# EAGLE design USB-LPC-Programmer_modular_V3.7 (EAGLE 6.4)
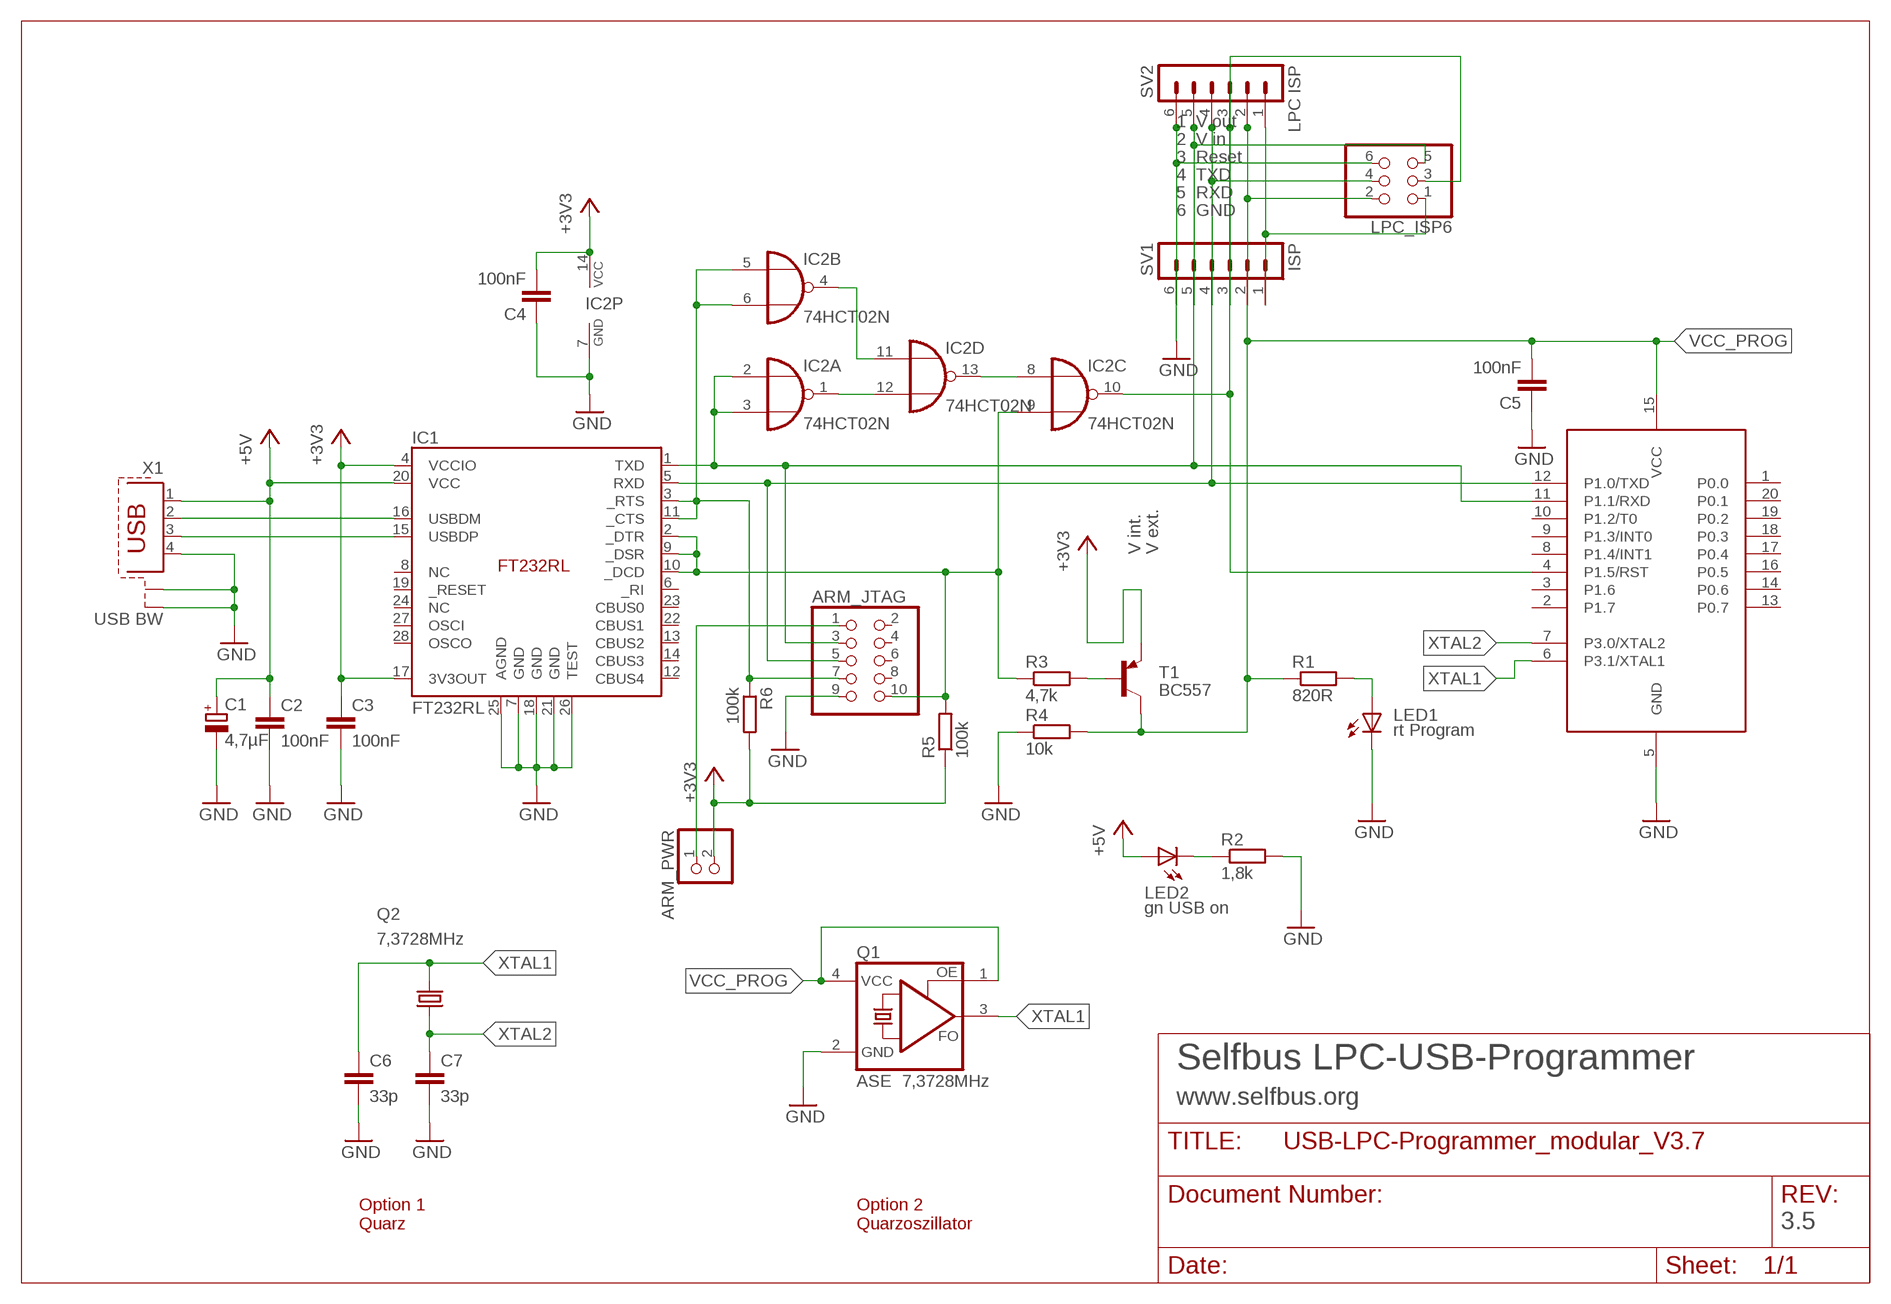
[diagram p0: schematic, sheet 1]

## Parts
89LPC922  LPC-Sockel  89LPC922  [DIL20]
ARM_JTAG  PINHD-2X05_2.00  [2X05M]
ARM_PWR  PINHD-1X02_2.54-S  [1X02-S]
C1  4,7µF  CPOL-EUE2.5-6  [E2,5-6]
C2  100nF  C-EU025-025X050  [C025-025X050]
C3  100nF  C-EU050-024X044  [C050-024X044]
C4  100nF  C-EU050-024X044  [C050-024X044]
C5  100nF  C-EU050-024X044  [C050-024X044]
C6  33p  C-EU025-024X044  [C025-024X044]
C7  33p  C-EU025-024X044  [C025-024X044]
IC1  FT232RL  [SSOP-28]
IC2  74HCT02N  [DIL14]
LED1  rt Program  LED3MM  [LED3MM]
LED2  gn USB on  LED3MM  [LED3MM]
LPC_ISP6  PINHD-2X3  [2X03]
Q1  ASE 7,3728MHz  ASF1  [ASF]
Q2  7,3728MHz  CRYSTALHC49S  [HC49/S]
R1  820R  R-EU_0207/7  [0207/7]
R2  1,8k  R-EU_0207/7  [0207/7]
R3  4,7k  R-EU_0204/7  [0204/7]
R4  10k  R-EU_0207/7  [0207/7]
R5  100k  R-EU_0207/7  [0207/7]
R6  100k  R-EU_0207/7  [0207/7]
SV1  ISP  MA06-1  [MA06-1]
SV2  LPC ISP  MA06-1  [MA06-1]
T1  BC557  [TO92]
X1  USB BW  PN61729-S  [PN61729-S]

## Nets
+3V3: ARM_PWR.2 C3.1 C4.2 IC1.4(VCCIO) IC1.17(3V3OUT) IC2.14(P:VCC) R5.1 R6.2 T1.1(E)
+5V: C1.+ C2.1 IC1.20(VCC) LED2.A X1.1
GND: 89LPC922.5(GND) ARM_JTAG.9 C1.- C2.2 C3.2 C4.1 C5.1 C6.2 C7.2 IC1.7(GND) IC1.18(GND) IC1.21(GND) IC1.25(AGND) IC1.26(TEST) IC2.7(P:GND) LED1.K(C) LPC_ISP6.6 Q1.2(GND) R2.2 R4.1 SV1.6 SV2.6 X1.4 X1.S1 X1.S2
N$1: LPC_ISP6.1 SV1.1 SV2.1
N$2: ARM_JTAG.1 ARM_PWR.1
N$3: IC2.4(B:O) IC2.11(D:I0)
N$5: 89LPC922.4(P1.5/RST) IC2.10(C:O) LPC_ISP6.3 SV1.3 SV2.3
N$9: LED2.K(C) R2.1
N$10: IC2.1(A:O) IC2.12(D:I1)
N$13: LED1.A R1.2
N$14: IC1.16(USBDM) X1.2
N$15: IC2.8(C:I0) IC2.13(D:O)
N$17: IC1.15(USBDP) X1.3
N$19: R3.2 T1.2(B)
PROG_PWR_ON: ARM_JTAG.10 IC1.2(_DTR) IC1.9(_DSR) IC1.10(_DCD) IC2.9(C:I1) R3.1 R5.2
RTS_CTS1: ARM_JTAG.7 IC1.3(_RTS) IC1.11(_CTS) IC2.5(B:I0) IC2.6(B:I1) R6.1
USB_RX: 89LPC922.12(P1.0/TXD) ARM_JTAG.5 IC1.5(RXD) LPC_ISP6.4 SV1.4 SV2.4
USB_TX: 89LPC922.11(P1.1/RXD) ARM_JTAG.3 IC1.1(TXD) IC2.2(A:I0) IC2.3(A:I1) LPC_ISP6.5 SV1.5 SV2.5
VCC_PROG: 89LPC922.15(VCC) C5.2 LPC_ISP6.2 Q1.1(OE) Q1.4(VCC) R1.1 R4.2 SV1.2 SV2.2 T1.3(C)
XTAL1: 89LPC922.6(P3.1/XTAL1) C6.1 Q1.3(FO) Q2.2
XTAL2: 89LPC922.7(P3.0/XTAL2) C7.1 Q2.1
Unconnected: 89LPC922.1(P0.0) 89LPC922.2(P1.7) 89LPC922.3(P1.6) 89LPC922.8(P1.4/INT1) 89LPC922.9(P1.3/INT0) 89LPC922.10(P1.2/T0) 89LPC922.13(P0.7) 89LPC922.14(P0.6) 89LPC922.16(P0.5) 89LPC922.17(P0.4) 89LPC922.18(P0.3) 89LPC922.19(P0.2) 89LPC922.20(P0.1) ARM_JTAG.2 ARM_JTAG.4 ARM_JTAG.6 ARM_JTAG.8 IC1.6(_RI) IC1.8(NC) IC1.12(CBUS4) IC1.13(CBUS2) IC1.14(CBUS3) IC1.19(_RESET) IC1.22(CBUS1) IC1.23(CBUS0) IC1.24(NC) IC1.27(OSCI) IC1.28(OSCO)

## Notes on the sheet
- 1  V out
- 2  V in
- 3  Reset
- 4  TXD
- 5  RXD
- 6  GND
- V int. | V ext.
- Selfbus LPC-USB-Programmer
- www.selfbus.org
- Option 1
  Quarz
- Option 2
  Quarzoszillator
- 3.5

## Library data of the parts
89LPC922 = micro-philips:89LPC922
ARM_JTAG = pinhead-2:PINHD-2X05: PIN HEADER
ARM_PWR = pinhead-2:PINHD-1X02: PIN HEADER
C1 = rcl:CPOL-EU: POLARIZED CAPACITOR, European symbol
C2-C7 = rcl:C-EU: CAPACITOR, European symbol
IC1 = ftdi4:FT232RL
IC2 = 74xx-eu:74*02: Quad 2-input NOR gate
LED1 LED2 = led:LED: LED OSRAM: - CHIPLED LG R971, LG N971, LY N971, LG Q971, LY Q971, LO R971, LY R971 LH N974, LH R974 LS Q976, LO Q976, LY Q976 LO Q996 - Hyper CHIPLED LW Q18S LB Q993, LB Q99A, LB R99A - SideLED LS A670, LO A670, LY A670, LG A670, LP A670 LB A673, LV A673, LT A673, LW A673 LH A674 LY A675 LS A676, LA A676, LO A676, LY A676, LW A676 LS A679, LY A679, LG A679 - Hyper Micro SIDELED® LS Y876, LA Y876, LO Y876, LY Y876 LT Y87S - SmartLED LW L88C, LW L88S LB L89C, LB L89S, LG L890 LS L89K, LO L89K, LY L89K LS L896, LA L896, LO L896, LY L896 - TOPLED LS T670, LO T670, LY T670, LG T670, LP T670 LSG T670, LSP T670, LSY T670, LOP T670, LYG T670 LG T671, LOG T671, LSG T671 LB T673, LV T673, LT T673, LW T673 LH T674 LS T676, LA T676, LO T676, LY T676, LB T676, LH T676, LSB T676, LW T676 LB T67C, LV T67C, LT T67C, LS T67K, LO T67K, LY T67K, LW E67C LS E67B, LA E67B, LO E67B, LY E67B, LB E67C, LV E67C, LT E67C LW T67C LS T679, LY T679, LG T679 LS T770, LO T770, LY T770, LG T770, LP T770 LB T773, LV T773, LT T773, LW T773 LH T774 LS E675, LA E675, LY E675, LS T675 LS T776, LA T776, LO T776, LY T776, LB T776 LHGB T686 LT T68C, LB T68C - Hyper Mini TOPLED® LB M676 - Mini TOPLED Santana® LG M470 LS M47K, LO M47K, LY M47K Source: http://www.osram.convergy.de LUXEON: - LUMILED® LXK2-PW12-R00, LXK2-PW12-S00, LXK2-PW14-U00, LXK2-PW14-V00 LXK2-PM12-R00, LXK2-PM12-S00, LXK2-PM14-U00 LXK2-PE12-Q00, LXK2-PE12-R00, LXK2-PE12-S00, LXK2-PE14-T00, LXK2-PE14-U00 LXK2-PB12-K00, LXK2-PB12-L00, LXK2-PB12-M00, LXK2-PB14-N00, LXK2-PB14-P00, LXK2-PB14-Q00 LXK2-PR12-L00, LXK2-PR12-M00, LXK2-PR14-Q00, LXK2-PR14-R00 LXK2-PD12-Q00, LXK2-PD12-R00, LXK2-PD12-S00 LXK2-PH12-R00, LXK2-PH12-S00 LXK2-PL12-P00, LXK2-PL12-Q00, LXK2-PL12-R00 Source: www.luxeon.com KINGBRIGHT: KA-3528ASYC Source: www.kingbright.com
LPC_ISP6 = pinhead:PINHD-2X3: PIN HEADER
Q1 = crystal:ASF*: CRYSTAL CLOCK OSCILLATORS 5.0 Vdc or 3.3 Vdc - LOW PROFILE ULTRA MINIATURE CERAMIC SURFACE MOUNT Source: http://www.abracon.com/Oscillators/asf1-L-L1.pdf; OC_FARNELL: unknown; OC_NEWARK: unknown
Q2 = crystal:CRYSTAL: CRYSTAL; OC_FARNELL: 1667008; OC_NEWARK: unknown
R1-R6 = rcl:R-EU_: RESISTOR, European symbol
SV1 SV2 = con-lstb:MA06-1: PIN HEADER; OC_FARNELL: unknown; OC_NEWARK: unknown
T1 = transistor-pnp:BC557: PNP Transistor
X1 = con-berg:PN61729-S: BERG USB connector; OC_FARNELL: unknown; OC_NEWARK: unknown

## Board
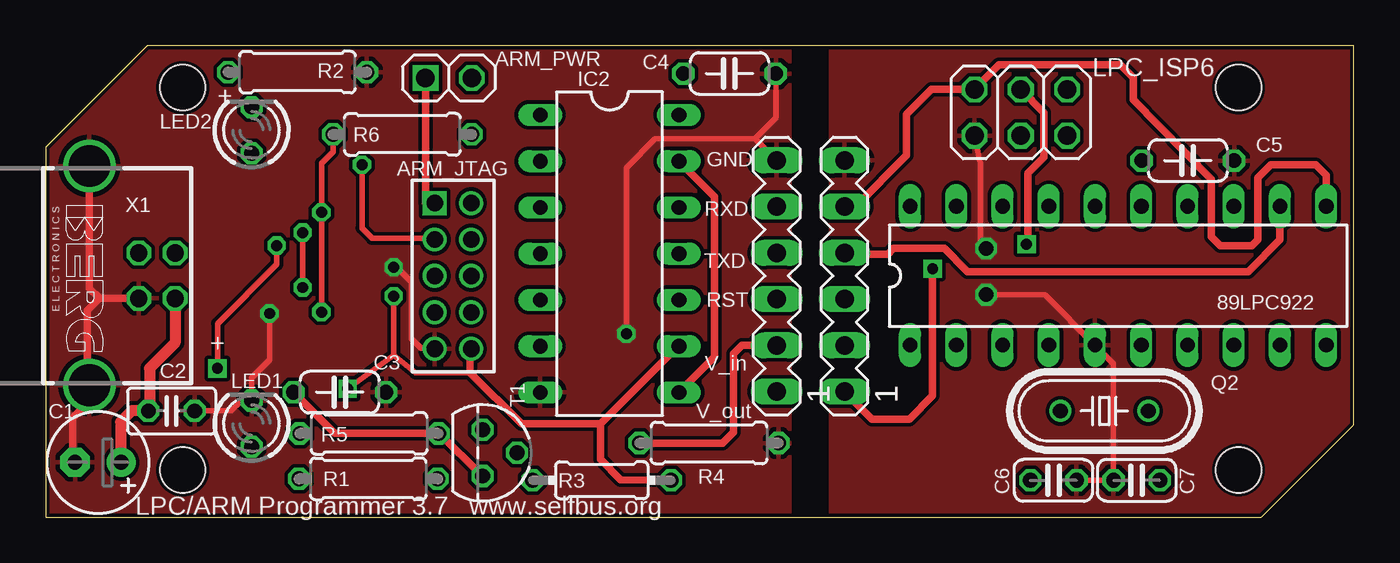
[diagram p1: board, top side]
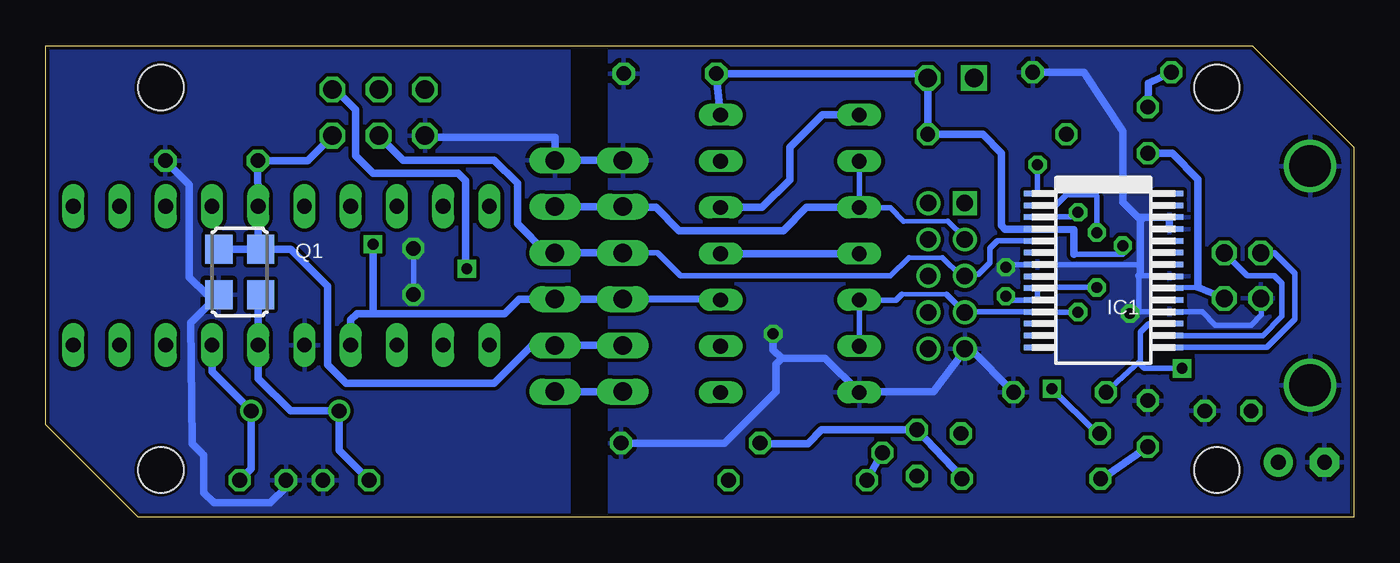
[diagram p2: board, bottom side, seen from below]

Size 71.88 x 25.91 mm. Coordinates in mm from the lower left corner, seen from the top.
Outline: 0,0 66.8,0 71.88,5.08 71.88,25.91 5.59,25.91 0,20.32 0,0
Copper layers (1*16): Top 0.035mm / dielectric 1.5mm / Bottom 0.035mm
Design rules: minimum track width 0.2mm, minimum drill 0.5mm, track to track 0.2mm, track to pad 0.2mm, pad to pad 0.15mm, via to via 0.2mm, smd to smd 0mil, copper to edge 0.2mm, drill to drill 0.2mm, minimum pad ring 0.2mm, minimum via ring 0.2mm, stop-mask expansion 0.1mm, vias tented up to drill 0mil, thermal gap 10mil
Holes 2.5 mm at 7.54,2.59 7.54,23.59 65.54,2.59 65.54,23.59
tRestrict: area 41,0.1 to 43,25.7
bRestrict: area 41,0.2 to 43,25.9

### Footprints (pad centres in the part's own frame; a part is rotated, then mirrored left to right if it is on the bottom)
DIL20 = drill 0.813 long: 1 -11.43,-3.81; 2 -8.89,-3.81; 3 -6.35,-3.81; 4 -3.81,-3.81; 5 -1.27,-3.81; 6 1.27,-3.81; 7 3.81,-3.81; 8 6.35,-3.81; 9 8.89,-3.81; 10 11.43,-3.81; 11 11.43,3.81; 12 8.89,3.81; 13 6.35,3.81; 14 3.81,3.81; 15 1.27,3.81; 16 -1.27,3.81; 17 -3.81,3.81; 18 -6.35,3.81; 19 -8.89,3.81; 20 -11.43,3.81
2X05M = drill 0.914 square: 1 -4,-1 | drill 0.914: 2 -4,1; 3 -2,-1; 4 -2,1; 5 0,-1; 6 0,1; 7 2,-1; 8 2,1; 9 4,-1; 10 4,1
1X02-S = drill 1.016 square: 1 -1.27,0 | drill 1.016 octagon: 2 1.27,0
E2,5-6 = drill 0.813 pad 1.6: + -1.27,0 | drill 0.813 pad 1.6 octagon: - 1.27,0
C025-025X050 = drill 0.813 octagon: 1 -1.27,0; 2 1.27,0
C050-024X044 = drill 0.813 octagon: 1 -2.54,0; 2 2.54,0
C025-024X044 = drill 0.813 octagon: 1 -1.27,0; 2 1.27,0
SSOP-28 = smd 0.3 x 1.5: 1 -4.225,-3.625; 2 -3.575,-3.625; 3 -2.925,-3.625; 4 -2.275,-3.625; 5 -1.625,-3.625; 6 -0.975,-3.625; 7 -0.325,-3.625; 8 0.325,-3.625; 9 0.975,-3.625; 10 1.625,-3.625; 11 2.275,-3.625; 12 2.925,-3.625; 13 3.575,-3.625; 14 4.225,-3.625; 15 4.225,3.625; 16 3.575,3.625; 17 2.925,3.625; 18 2.275,3.625; 19 1.625,3.625; 20 0.975,3.625; 21 0.325,3.625; 22 -0.325,3.625; 23 -0.975,3.625; 24 -1.625,3.625; 25 -2.275,3.625; 26 -2.925,3.625; 27 -3.575,3.625; 28 -4.225,3.625
DIL14 = drill 0.813 long: 1 -7.62,-3.81; 2 -5.08,-3.81; 3 -2.54,-3.81; 4 0,-3.81; 5 2.54,-3.81; 6 5.08,-3.81; 7 7.62,-3.81; 8 7.62,3.81; 9 5.08,3.81; 10 2.54,3.81; 11 0,3.81; 12 -2.54,3.81; 13 -5.08,3.81; 14 -7.62,3.81
LED3MM = drill 0.813 octagon: A -1.27,0; K 1.27,0
2X03 = drill 1.016 octagon: 1 -2.54,-1.27; 2 -2.54,1.27; 3 0,-1.27; 4 0,1.27; 5 2.54,-1.27; 6 2.54,1.27
ASF = smd 1.6 x 1.5: 1 -1.25,-1.15; 2 1.25,-1.15; 3 1.25,1.15; 4 -1.25,1.15
HC49/S = drill 0.813: 1 -2.413,0; 2 2.413,0
0207/7 = drill 0.813 octagon: 1 -3.81,0; 2 3.81,0
0204/7 = drill 0.813 octagon: 1 -3.81,0; 2 3.81,0
MA06-1 = drill 1.016 long: 1 -6.35,0; 2 -3.81,0; 3 -1.27,0; 4 1.27,0; 5 3.81,0; 6 6.35,0
TO92 = drill 0.813 octagon: 1 1.27,0; 2 0,1.905; 3 -1.27,0
PN61729-S = drill 0.95 octagon: 1 1.25,4.71; 2 -1.25,4.71; 3 -1.25,2.71; 4 1.25,2.71 | drill 2.3 pad 2.9: S1 -6.02,0; S2 6.02,0

### Placement (x,y rotation side)
89LPC922  58.93,13.27 0 top
ARM_JTAG  22.38,13.26 270 top
ARM_PWR  22.15,24.13 0 top
C1  2.89,3.02 180 top
C2  6.92,5.84 0 top
C3  16.16,6.87 0 top
C4  37.58,24.37 180 top
C5  62.75,19.59 180 top
C6  55.37,2.03 0 top
C7  59.94,2.03 180 top
IC1  13.76,13.56 270 bottom
IC2  30.99,14.48 270 top
LED1  11.32,5.14 90 top
LED2  11.32,21.26 90 top
LPC_ISP6  53.58,22.23 180 top
Q1  61.21,13.46 270 bottom
Q2  58.17,5.84 180 top
R1  17.73,2.11 180 top
R2  13.84,24.45 0 top
R3  30.56,2.03 180 top
R4  36.45,4.08 180 top
R5  17.78,4.6 180 top
R6  19.61,21.03 0 top
SV1  40.16,13.26 90 top
SV2  43.89,13.26 90 top
T1  24,3.54 270 top
X1  2.41,13.27 270 top

### Tracks (layer width: path | path; a pad name or v marks a point on that pad's centre or on a via)
+3V3  (via drill 0.6)
  Top 0.305: v12.7,14.92 12.7,13.89 9.45,10.64 v9.45,8.18
  Top 0.406: T1.1 R5.1 15.89,4.6 C3.1
  Bottom 0.305: 15.4,14.45 12.7,14.45 v12.7,14.92 | IC1.17 11.28,10.63 11.75,10.16 11.75,8.59 | 11.75,8.59 C3.1 | v9.45,8.18 10.7,8.18 11.51,8.18 11.75,8.41 11.75,8.59
  Bottom 0.406: IC2.14 C4.2 23.65,24.37 ARM_PWR.2 R6.2 20.4,21.03 19.37,20 19.37,19.76 19.37,16.03 19.17,15.83 IC1.4 15.4,15.8 15.4,14.45
+5V
  Top 0.61: C1.+ 4.13,3.05 4.13,5.24 4.76,5.87 5.62,5.87 C2.1 5.71,5.91 5.71,8.18 7.12,9.58 X1.1
  Bottom 0.305: 10.1,12.62 IC1.20 8.57,12.62
  Bottom 0.406: LED2.A 9.98,19.99 8.57,18.57 8.57,12.62 X1.1
GND  (via drill 0.6, 0.8)
  Top 0.305: 2.3,7.36 X1.S2 | 1.51,3.13 C1.- | v19.13,13.73 19.29,13.73 20.08,12.94 20.08,9.84 20.64,9.29 21.35,9.29 ARM_JTAG.9 | v12.3,11.19 12.3,8.65 11.32,7.67 LED1.K 10.72,6.35 10.21,5.84 C2.2 | SV1.6 38.97,20.8 | 38.97,20.8 33.5,20.8 31.91,19.21 v31.91,10.08 | 38.97,20.8 40.12,21.94 C4.1 | v51.67,14.76 51.36,15.08 51.36,19.45 LPC_ISP6.6 | v51.67,12.22 54.9,12.22 89LPC922.5 58.67,8.45 C7.2 C6.2
  Top 0.406: X1.4 2.97,12.02 | 2.97,12.02 2.3,11.35 2.3,7.36 | X1.S2 2.41,6.38 1.51,5.48 1.51,3.13 | 2.97,12.02 2.41,12.58 X1.S1
  Bottom 0.305: 11.83,11.28 IC1.18 8.35,11.28 7.62,10.56 5.64,10.56 5.08,11.11 5.08,11.98 X1.4 | 11.83,11.28 11.83,13.26 10.14,13.26 IC1.21 | v19.13,13.73 18.9,13.88 IC1.7 11.76,13.88 11.75,13.89 | v12.3,11.19 11.89,11.35 11.83,11.28 | v51.67,14.76 v51.67,12.22
  Bottom 0.406: SV1.6 SV2.6 43.89,20.88 50.96,20.88 LPC_ISP6.6 | IC1.26 IC1.25 | IC1.26 11.54,16.48 11.75,16.27 11.75,13.89 11.75,13.34 11.83,13.26 | R2.2 14.84,24.45 12.7,21.19 12.7,17.3 11.88,16.48 IC1.26 | R4.1 34.58,4.08 31.75,6.91 31.75,8.41 31.43,8.73 | 27.23,6.91 IC2.7 | IC2.7 27.13,6.91 23.1,6.91 21.38,9.18 ARM_JTAG.9 21.08,9.26 C3.2 | 31.43,8.73 29.05,8.73 IC2.7 | 31.43,8.73 31.91,9.21 v31.91,10.08 | C5.1 63.98,18.27 63.98,13.18 63.01,12.21 Q1.2 63.9,10.68 63.82,4.13 63.82,4.05 63.18,3.41 63.18,1.35 62.63,0.79 59.53,0.79 58.67,1.65 C7.2
  pour Bottom: 0,0 66.8,0 71.88,5.08 71.88,25.91 5.59,25.91 0,20.32
  pour Top: 0,0 66.8,0 71.88,5.08 71.88,25.91 5.59,25.91 0,20.32
N$1  (via drill 0.6)
  Top 0.406: v48.74,13.65 48.74,6.67 47.47,5.4 45.4,5.4 SV2.1
  Bottom 0.406: SV2.1 SV1.1 | LPC_ISP6.1 55.96,23.5 54.85,22.38 54.85,19.84 53.9,18.89 49.21,18.89 48.82,18.49 48.82,13.49 v48.74,13.65
N$2
  Top 0.406: ARM_PWR.1 20.88,17.26 ARM_JTAG.1
N$3
  Bottom 0.406: IC2.4 IC2.11
N$5  (via drill 0.6)
  Top 0.406: LPC_ISP6.3 54.85,22.23 54.85,19.76 53.98,18.89 53.98,15.08 v53.9,15
  Bottom 0.406: IC2.10 34.8,12 SV1.3 SV2.3 | 43.99,12 SV2.3 | v53.9,15 53.9,11.19 | 89LPC922.4 55.12,10.84 54.77,11.19 53.9,11.19 | 53.9,11.19 46.67,11.19 45.88,11.99 SV2.3
N$9
  Bottom 0.406: R2.1 11.3,23.83 LED2.K
N$10
  Bottom 0.406: IC2.1 29.21,22.1 30.99,20.32 30.99,18.54 32.51,17.02 IC2.12
N$13
  Bottom 0.406: LED1.A 13.86,2.13 R1.2
N$14
  Bottom 0.305: IC1.16 5.02,9.98 3.97,11.03 3.97,12.86 4.37,13.26 5.86,13.26 X1.2
N$15
  Top 0.406: IC2.13 36.75,17.61 36.75,8.81 IC2.8
N$17
  Bottom 0.305: IC1.15 4.8,9.33 3.25,10.87 3.25,13.41 4.37,14.53 X1.3
N$19
  Bottom 0.406: R3.2 26.04,3.33 T1.2
PROG_PWR_ON  (via drill 0.6)
  Top 0.305: v14.13,15.64 v14.13,12.62 | v19.13,12.14 19.13,8.89 | 19.13,8.89 20.32,7.94 23.34,7.94 | 19.13,8.89 v16.59,7.06
  Top 0.406: R3.1 31.59,2.06 30.48,3.17 30.48,5.13 | 30.48,5.13 26.15,5.13 23.34,7.94 23.34,9.21 ARM_JTAG.10 | 30.48,5.13 34.67,9.32 IC2.9
  Bottom 0.305: v19.13,12.14 18.92,11.93 IC1.10 IC1.9 17.35,12.62 v14.13,12.62 | IC1.2 16.36,17.13 15.8,17.7 14.21,17.7 14.13,17.62 v14.13,15.64 | 14.13,4.6 v16.59,7.06
  Bottom 0.406: R5.2 14.13,4.6
RTS_CTS1  (via drill 0.6)
  Top 0.305: v15.16,11.27 v15.16,16.75 15.16,19.45 15.8,20.08 R6.1
  Bottom 0.254: 22.38,12.26 24.84,12.26
  Bottom 0.305: 22.38,12.26 21.42,11.26 ARM_JTAG.7 21.36,11.28 IC1.11 17.38,11.27 v15.16,11.27 | 24.84,12.26 25.16,11.91 27.15,11.91 IC2.5 IC2.6 | v15.16,16.75 15.56,16.51 17.36,16.51 IC1.3
USB_RX
  Top 0.406: 89LPC922.12 67.82,15.24 66.07,13.49 50.64,13.49 49.37,14.76 46.59,14.76 46.28,14.45 43.97,14.45 SV2.4
  Bottom 0.254: 22.62,14.26 24.45,14.26
  Bottom 0.305: IC1.5 19.58,15.18 20,14.76 20,13.97 20.64,13.34 21.3,13.34 ARM_JTAG.5 21.59,13.26 22.62,14.26 | 24.45,14.26 25.48,13.26 36.99,13.26 38.26,14.53 SV1.4
  Bottom 0.406: SV1.4 40.24,14.61 40.8,14.61 40.88,14.53 SV2.4 43.91,14.54 44.39,14.54 45.96,16.11 45.96,18.34 47.23,19.61 52.23,19.61 LPC_ISP6.4
USB_TX  (via drill 0.6)
  Top 0.305: v17.38,19.37 17.38,15.88 17.94,15.32 21.32,15.32 ARM_JTAG.3
  Top 0.406: 89LPC922.11 70.36,18.8 69.79,19.37 67.31,19.37 66.6,18.65 66.6,15.24 66.28,14.92 64.53,14.92 64.06,15.4 64.06,18.57 59.77,22.94 59.77,24.13 59.05,24.84 52.39,24.84 LPC_ISP6.5 48.66,23.5 47.31,22.15 47.31,19.88 44.51,17.08 43.91,17.08 SV2.5
  Bottom 0.254: 22.3,16.26 24.77,16.26
  Bottom 0.305: ARM_JTAG.3 21.38,15.35 22.3,16.26 | 24.77,16.26 25.48,16.99 27.15,16.99 IC2.3 IC2.2 | IC1.1 v17.39,19.36 v17.38,19.37
  Bottom 0.406: IC2.3 30.07,17.02 31.34,15.75 37.08,15.75 38.35,17.02 40.13,17.02 SV1.5 SV2.5
VCC_PROG
  Top 0.406: R4.2 37.18,4.08 37.78,4.68 37.78,8.97 38.26,9.45 SV1.2
  Bottom 0.406: Q1.4 60.2,14.85 89LPC922.15 C5.2 57.48,19.59 LPC_ISP6.2 | Q1.4 60.04,14.73 58.42,14.73 56.39,12.7 56.39,8.38 55.37,7.37 47.24,7.37 45.15,9.46 43.91,9.46 SV2.2 SV1.2 | Q1.1 Q1.4 | R1.1 21.54,2.19 T1.3 29.24,4.81 30,4.05 32.61,4.05 R4.2
XTAL1
  Bottom 0.406: Q1.3 60.2,12.21 89LPC922.6 60.2,7.62 58.42,5.84 Q2.2 55.75,3.68 C6.1
XTAL2
  Bottom 0.406: 89LPC922.7 62.74,8 Q2.1 60.58,2.67 C7.1

### Text on the board
tPlace: + | GND | RXD | TXD | RST | + | V_in | V_out | LPC/ARM Programmer 3.7 www.selfbus.org